# Altium project StudioLightPanel.PrjPcb
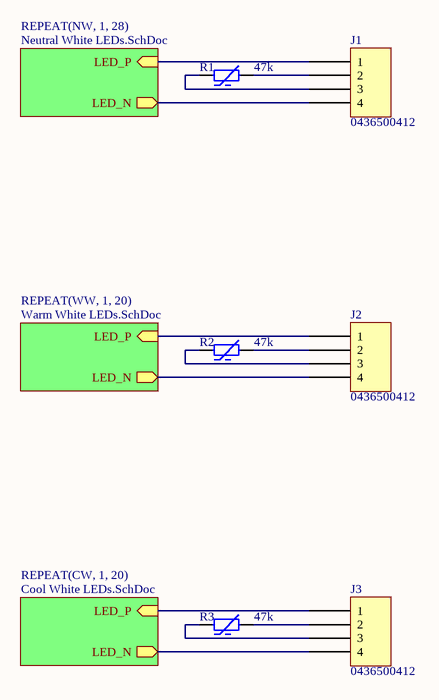
[diagram p0: Studio Light Panel.SchDoc]
4 sheets, 278 parts. Net scope: hierarchical (ports join the sheet entries above them; power ports are global).
Board files: Light Panel.PcbDoc, JumperBoard.PcbDoc
Sheets:
  Studio Light Panel.SchDoc
    CW1 = Cool White LEDs.SchDoc
    CW2 = Cool White LEDs.SchDoc
    CW3 = Cool White LEDs.SchDoc
    CW4 = Cool White LEDs.SchDoc
    CW5 = Cool White LEDs.SchDoc
    CW6 = Cool White LEDs.SchDoc
    CW7 = Cool White LEDs.SchDoc
    CW8 = Cool White LEDs.SchDoc
    CW9 = Cool White LEDs.SchDoc
    CW10 = Cool White LEDs.SchDoc
    CW11 = Cool White LEDs.SchDoc
    CW12 = Cool White LEDs.SchDoc
    CW13 = Cool White LEDs.SchDoc
    CW14 = Cool White LEDs.SchDoc
    CW15 = Cool White LEDs.SchDoc
    CW16 = Cool White LEDs.SchDoc
    CW17 = Cool White LEDs.SchDoc
    CW18 = Cool White LEDs.SchDoc
    CW19 = Cool White LEDs.SchDoc
    CW20 = Cool White LEDs.SchDoc
    WW1 = Warm White LEDs.SchDoc
    WW2 = Warm White LEDs.SchDoc
    WW3 = Warm White LEDs.SchDoc
    WW4 = Warm White LEDs.SchDoc
    WW5 = Warm White LEDs.SchDoc
    WW6 = Warm White LEDs.SchDoc
    WW7 = Warm White LEDs.SchDoc
    WW8 = Warm White LEDs.SchDoc
    WW9 = Warm White LEDs.SchDoc
    WW10 = Warm White LEDs.SchDoc
    WW11 = Warm White LEDs.SchDoc
    WW12 = Warm White LEDs.SchDoc
    WW13 = Warm White LEDs.SchDoc
    WW14 = Warm White LEDs.SchDoc
    WW15 = Warm White LEDs.SchDoc
    WW16 = Warm White LEDs.SchDoc
    WW17 = Warm White LEDs.SchDoc
    WW18 = Warm White LEDs.SchDoc
    WW19 = Warm White LEDs.SchDoc
    WW20 = Warm White LEDs.SchDoc
    NW1 = Neutral White LEDs.SchDoc
    NW2 = Neutral White LEDs.SchDoc
    NW3 = Neutral White LEDs.SchDoc
    NW4 = Neutral White LEDs.SchDoc
    NW5 = Neutral White LEDs.SchDoc
    NW6 = Neutral White LEDs.SchDoc
    NW7 = Neutral White LEDs.SchDoc
    NW8 = Neutral White LEDs.SchDoc
    NW9 = Neutral White LEDs.SchDoc
    NW10 = Neutral White LEDs.SchDoc
    NW11 = Neutral White LEDs.SchDoc
    NW12 = Neutral White LEDs.SchDoc
    NW13 = Neutral White LEDs.SchDoc
    NW14 = Neutral White LEDs.SchDoc
    NW15 = Neutral White LEDs.SchDoc
    NW16 = Neutral White LEDs.SchDoc
    NW17 = Neutral White LEDs.SchDoc
    NW18 = Neutral White LEDs.SchDoc
    NW19 = Neutral White LEDs.SchDoc
    NW20 = Neutral White LEDs.SchDoc
    NW21 = Neutral White LEDs.SchDoc
    NW22 = Neutral White LEDs.SchDoc
    NW23 = Neutral White LEDs.SchDoc
    NW24 = Neutral White LEDs.SchDoc
    NW25 = Neutral White LEDs.SchDoc
    NW26 = Neutral White LEDs.SchDoc
    NW27 = Neutral White LEDs.SchDoc
    NW28 = Neutral White LEDs.SchDoc

## Sheet Studio Light Panel.SchDoc: Studio Light Panel
size A4; SheetNumber: 1; SheetTotal: 4

### Parts
J1  0436500412  [MOLEX 436500412]
J2  0436500412  [MOLEX 436500412]
J3  0436500412  [MOLEX 436500412]
R1  47k  [NTC 0402_1005]
R2  47k  [NTC 0402_1005]
R3  47k  [NTC 0402_1005]

### Sub-sheets
REPEAT(CW, 1, 20) = Cool White LEDs.SchDoc: LED_P (in), LED_N (out)
REPEAT(NW, 1, 28) = Neutral White LEDs.SchDoc: LED_P (in), LED_N (out)
REPEAT(WW, 1, 20) = Warm White LEDs.SchDoc: LED_P (in), LED_N (out)

### Nets
NetD1_WW1_A: J2.1 ; sheet REPEAT(WW, 1, 20)/LED_P
NetD4_WW1_C: J2.4 ; sheet REPEAT(WW, 1, 20)/LED_N
NetD5_CW1_A: J3.1 ; sheet REPEAT(CW, 1, 20)/LED_P
NetD8_CW1_C: J3.4 ; sheet REPEAT(CW, 1, 20)/LED_N
NetD9_NW1_A: J1.1 ; sheet REPEAT(NW, 1, 28)/LED_P
NetD12_NW1_C: J1.4 ; sheet REPEAT(NW, 1, 28)/LED_N
NetJ1_2: J1.2 R1.2
NetJ1_3: J1.3 R1.1
NetJ2_2: J2.2 R2.2
NetJ2_3: J2.3 R2.1
NetJ3_2: J3.2 R3.2
NetJ3_3: J3.3 R3.1

### Notes on the sheet
- Title
- Size:
- Date:
- A4
- Number:
- Time:
- Revision:
- Sheet
- of
- File:

### Library data of the parts
J1-J3 = 0436500412: CONN HEADER SMD R/A 4POS 3MM; Manufacturer: Molex; Material Flammability Rating: UL94 V-0; Number of Positions: 4; Number of Positions Loaded: All; Pitch - Mating: 0.118" (3.00mm); Shrouding: Shrouded - 4 Wall; Style: Board to Cable/Wire; Part Number: 0436500412; ComponentLink1Description: Datasheet; ComponentLink1URL: https://www.molex.com/pdm_docs/sd/436500412_sd.pdf; ComponentLink2Description: DigiKey Link; ComponentLink2URL: https://www.digikey.com/en/products/detail/molex/0436500412/3451041; Connector Type: Header; Contact Finish - Mating: Tin; Contact Finish - Post: Tin; Contact Finish Thickness - Mating: 60.0µin (1.52µm); Contact Material: Brass; Contact Shape: Square; Contact Type: Male Pin; Fastening Type: Locking Ramp; Features: Solder Retention; Insulation Color: Black; Insulation Height: 0.172" (4.37mm); Insulation Material: Liquid Crystal Polymer (LCP), Glass Filled; LastUpdated: 21/03/2022 20:35:03; Lifecycle Status: Active; Minimum Order: 1; Mounting Type: Surface Mount, Right Angle; Number of Rows: 1; Packaging: TapeAndReel; PartId: 134; Part Status: Active; Price: 1.64; Series: Micro-Fit 3.0 43650; Supplier 1: DigiKey; Supplier Part Number 1: WM1892CT-ND; Termination: Solder
R1-R3 = NTCG104BF473FT1X: THERMISTOR NTC 47KOHM 4485K 0402; Manufacturer: TDK Corporation; B25/85: 4550K; B Value Tolerance: ±1%; Power - Max: 100 mW; Part Number: NTCG104BF473FT1X; B25/50: 4485K; ComponentLink1Description: Datasheet; ComponentLink1URL: https://product.tdk.com/info/en/catalog/datasheets/503021/tpd_commercial_ntc-thermistor_ntcg_en.pdf?ref_disty=digikey; ComponentLink2Description: DigiKey Link; ComponentLink2URL: https://www.digikey.com/en/products/detail/tdk-corporation/NTCG104BF473FT1X/5285693; Device Package: 0402 (1005 Metric); LastUpdated: 21/03/2022 19:01:14; Lifecycle Status: Active; Minimum Order: 1; Mounting Type: Surface Mount; Operating Temperature: -40°C ~ 125°C; Package / Case: 0402 (1005 Metric); Packaging: TapeAndReel; PartId: 53; Part Status: Active; Price: 0.03; Resistance in Ohms @ 25°C: 47k; Resistance Tolerance: ±1%; Series: NTCG; Supplier 1: DigiKey; Supplier Part Number 1: 445-174900-1-ND; Value: 47k

## Sheet Cool White LEDs.SchDoc: Cool White
size A4; SheetNumber: 3; SheetTotal: 4
Used 20 times, as channels CW1, CW2, CW3, CW4, CW5, CW6, CW7, CW8, CW9, CW10, CW11, CW12, CW13, CW14, CW15, CW16, CW17, CW18, CW19, CW20. Parts and nets are listed once, with the designators drawn on the sheet.
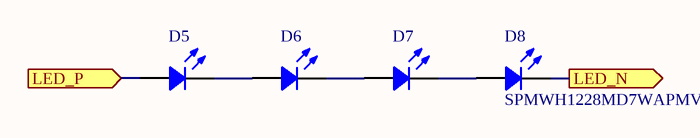
[diagram p1: Cool White LEDs.SchDoc]

### Parts
D5  SPMWH1228MD7WAPMVL  [SAMSUNG LM281BPLUS]  (value not drawn)
D6  SPMWH1228MD7WAPMVL  [SAMSUNG LM281BPLUS]  (value not drawn)
D7  SPMWH1228MD7WAPMVL  [SAMSUNG LM281BPLUS]  (value not drawn)
D8  SPMWH1228MD7WAPMVL  [SAMSUNG LM281BPLUS]

### Ports
LED_N (out), LED_P (in)

### Nets
LED_N: D8.C ; port LED_N
LED_P: D5.A ; port LED_P
NetD5_C: D5.C D6.A
NetD6_C: D6.C D7.A
NetD7_C: D7.C D8.A

### Channels
CW1: designators end in _CW1; ports LED_N=NetD8_CW1_C LED_P=NetD5_CW1_A
CW2: designators end in _CW2; ports LED_N=NetD8_CW1_C LED_P=NetD5_CW1_A
CW3: designators end in _CW3; ports LED_N=NetD8_CW1_C LED_P=NetD5_CW1_A
CW4: designators end in _CW4; ports LED_N=NetD8_CW1_C LED_P=NetD5_CW1_A
CW5: designators end in _CW5; ports LED_N=NetD8_CW1_C LED_P=NetD5_CW1_A
CW6: designators end in _CW6; ports LED_N=NetD8_CW1_C LED_P=NetD5_CW1_A
CW7: designators end in _CW7; ports LED_N=NetD8_CW1_C LED_P=NetD5_CW1_A
CW8: designators end in _CW8; ports LED_N=NetD8_CW1_C LED_P=NetD5_CW1_A
CW9: designators end in _CW9; ports LED_N=NetD8_CW1_C LED_P=NetD5_CW1_A
CW10: designators end in _CW10; ports LED_N=NetD8_CW1_C LED_P=NetD5_CW1_A
CW11: designators end in _CW11; ports LED_N=NetD8_CW1_C LED_P=NetD5_CW1_A
CW12: designators end in _CW12; ports LED_N=NetD8_CW1_C LED_P=NetD5_CW1_A
CW13: designators end in _CW13; ports LED_N=NetD8_CW1_C LED_P=NetD5_CW1_A
CW14: designators end in _CW14; ports LED_N=NetD8_CW1_C LED_P=NetD5_CW1_A
CW15: designators end in _CW15; ports LED_N=NetD8_CW1_C LED_P=NetD5_CW1_A
CW16: designators end in _CW16; ports LED_N=NetD8_CW1_C LED_P=NetD5_CW1_A
CW17: designators end in _CW17; ports LED_N=NetD8_CW1_C LED_P=NetD5_CW1_A
CW18: designators end in _CW18; ports LED_N=NetD8_CW1_C LED_P=NetD5_CW1_A
CW19: designators end in _CW19; ports LED_N=NetD8_CW1_C LED_P=NetD5_CW1_A
CW20: designators end in _CW20; ports LED_N=NetD8_CW1_C LED_P=NetD5_CW1_A

### Notes on the sheet
- Title
- Size:
- Date:
- A4
- Number:
- Time:
- Revision:
- Sheet
- of
- File:

### Library data of the parts
D5-D8 = SPMWH1228MD7WAPMVL: LED; Manufacturer: Samsung Semiconductor, Inc.; CCT (K): 6500K; Color: White, Cool; CRI (Color Rendering Index): 90; Current - Max: 250mA; Current - Test: 65mA; Flux @ 25°C, Current - Test: 33lm (32lm ~ 34lm); Lumens/Watt @ Current - Test: 181 lm/W; Viewing Angle: 120°; Voltage - Forward (Vf) (Typ): 2.8V; Part Number: SPMWH1228MD7WAPMVL; ComponentLink1Description: Datasheet; ComponentLink1URL: https://media.digikey.com/pdf/Data%20Sheets/Samsung%20PDFs/LM281B_Plus%20Pro_VLrank_Rev_0.3_8-4-20.pdf; ComponentLink2Description: DigiKey Link; ComponentLink2URL: https://www.digikey.com/en/products/detail/samsung-semiconductor-inc/SPMWH1228MD7WAPMVL/13926354; Device Package: 1411 (3528 Metric); Height - Seated (Max): 0.031" (0.80mm); LastUpdated: 21/03/2022 19:15:16; Lifecycle Status: Active; Minimum Order: 1; Mounting Type: Surface Mount; Package / Case: 1411 (3528 Metric); Packaging: TapeAndReel; PartId: 129; Part Status: Active; Price: 0.05; Series: LM281B+; Size / Dimension: 0.138" L x 0.110" W (3.50mm x 2.80mm); Supplier 1: DigiKey; Supplier Part Number 1: 1510-SPMWH1228MD7WAPMVLCT-ND; Supplier Device Package: 1411

## Sheet Warm White LEDs.SchDoc: Warm White
size A4; SheetNumber: 2; SheetTotal: 4
Used 20 times, as channels WW1, WW2, WW3, WW4, WW5, WW6, WW7, WW8, WW9, WW10, WW11, WW12, WW13, WW14, WW15, WW16, WW17, WW18, WW19, WW20. Parts and nets are listed once, with the designators drawn on the sheet.
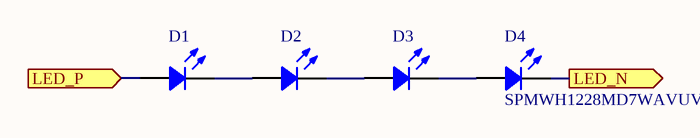
[diagram p2: Warm White LEDs.SchDoc]

### Parts
D1  SPMWH1228MD7WAVUVK  [SAMSUNG LM281BPLUS]  (value not drawn)
D2  SPMWH1228MD7WAVUVK  [SAMSUNG LM281BPLUS]  (value not drawn)
D3  SPMWH1228MD7WAVUVK  [SAMSUNG LM281BPLUS]  (value not drawn)
D4  SPMWH1228MD7WAVUVK  [SAMSUNG LM281BPLUS]

### Ports
LED_N (out), LED_P (in)

### Nets
LED_N: D4.C ; port LED_N
LED_P: D1.A ; port LED_P
NetD1_C: D1.C D2.A
NetD2_C: D2.C D3.A
NetD3_C: D3.C D4.A

### Channels
WW1: designators end in _WW1; ports LED_N=NetD4_WW1_C LED_P=NetD1_WW1_A
WW2: designators end in _WW2; ports LED_N=NetD4_WW1_C LED_P=NetD1_WW1_A
WW3: designators end in _WW3; ports LED_N=NetD4_WW1_C LED_P=NetD1_WW1_A
WW4: designators end in _WW4; ports LED_N=NetD4_WW1_C LED_P=NetD1_WW1_A
WW5: designators end in _WW5; ports LED_N=NetD4_WW1_C LED_P=NetD1_WW1_A
WW6: designators end in _WW6; ports LED_N=NetD4_WW1_C LED_P=NetD1_WW1_A
WW7: designators end in _WW7; ports LED_N=NetD4_WW1_C LED_P=NetD1_WW1_A
WW8: designators end in _WW8; ports LED_N=NetD4_WW1_C LED_P=NetD1_WW1_A
WW9: designators end in _WW9; ports LED_N=NetD4_WW1_C LED_P=NetD1_WW1_A
WW10: designators end in _WW10; ports LED_N=NetD4_WW1_C LED_P=NetD1_WW1_A
WW11: designators end in _WW11; ports LED_N=NetD4_WW1_C LED_P=NetD1_WW1_A
WW12: designators end in _WW12; ports LED_N=NetD4_WW1_C LED_P=NetD1_WW1_A
WW13: designators end in _WW13; ports LED_N=NetD4_WW1_C LED_P=NetD1_WW1_A
WW14: designators end in _WW14; ports LED_N=NetD4_WW1_C LED_P=NetD1_WW1_A
WW15: designators end in _WW15; ports LED_N=NetD4_WW1_C LED_P=NetD1_WW1_A
WW16: designators end in _WW16; ports LED_N=NetD4_WW1_C LED_P=NetD1_WW1_A
WW17: designators end in _WW17; ports LED_N=NetD4_WW1_C LED_P=NetD1_WW1_A
WW18: designators end in _WW18; ports LED_N=NetD4_WW1_C LED_P=NetD1_WW1_A
WW19: designators end in _WW19; ports LED_N=NetD4_WW1_C LED_P=NetD1_WW1_A
WW20: designators end in _WW20; ports LED_N=NetD4_WW1_C LED_P=NetD1_WW1_A

### Notes on the sheet
- Title
- Size:
- Date:
- A4
- Number:
- Time:
- Revision:
- Sheet
- of
- File:

### Library data of the parts
D1-D4 = SPMWH1228MD7WAVUVK: LED; Manufacturer: Samsung Semiconductor, Inc.; CCT (K): 3000K 3-Step MacAdam Ellipse; Color: White, Warm; CRI (Color Rendering Index): 90; Current - Max: 200mA; Current - Test: 65mA; Flux @ 25°C, Current - Test: 30lm (29lm ~ 31lm); Lumens/Watt @ Current - Test: 165 lm/W; Viewing Angle: 120°; Voltage - Forward (Vf) (Typ): 2.8V; Part Number: SPMWH1228MD7WAVUVK; ComponentLink1Description: Datasheet; ComponentLink1URL: https://cdn.samsung.com/led/file/resource/2020/07/Data_Sheet_LM281B_Plus_Pro_VK_Rev.0.8.pdf; ComponentLink2Description: DigiKey Link; ComponentLink2URL: https://www.digikey.com/en/products/detail/samsung-semiconductor-inc/SPMWH1228MD7WAVUVK/12083623; Height - Seated (Max): 0.030" (0.75mm); LastUpdated: 21/03/2022 19:15:16; Lifecycle Status: Active; Minimum Order: 1; Mounting Type: Surface Mount; Packaging: TapeAndReel; PartId: 112; Part Status: Active; Price: 0.03; Series: LM281B+; Size / Dimension: 0.138" L x 0.110" W (3.50mm x 2.80mm); Supplier 1: DigiKey; Supplier Part Number 1: 1510-SPMWH1228MD7WAVUVKCT-ND; Supplier Device Package: 2835

## Sheet Neutral White LEDs.SchDoc: Neutral White
size A4; SheetNumber: 4; SheetTotal: 4
Used 28 times, as channels NW1, NW2, NW3, NW4, NW5, NW6, NW7, NW8, NW9, NW10, NW11, NW12, NW13, NW14, NW15, NW16, NW17, NW18, NW19, NW20, NW21, NW22, NW23, NW24, NW25, NW26, NW27, NW28. Parts and nets are listed once, with the designators drawn on the sheet.
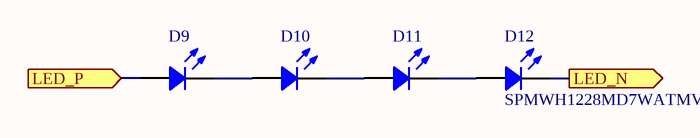
[diagram p3: Neutral White LEDs.SchDoc]

### Parts
D9  SPMWH1228MD7WATMVL  [SAMSUNG LM281BPLUS]  (value not drawn)
D10  SPMWH1228MD7WATMVL  [SAMSUNG LM281BPLUS]  (value not drawn)
D11  SPMWH1228MD7WATMVL  [SAMSUNG LM281BPLUS]  (value not drawn)
D12  SPMWH1228MD7WATMVL  [SAMSUNG LM281BPLUS]

### Ports
LED_N (out), LED_P (in)

### Nets
LED_N: D12.C ; port LED_N
LED_P: D9.A ; port LED_P
NetD9_C: D9.C D10.A
NetD10_C: D10.C D11.A
NetD11_C: D11.C D12.A

### Channels
NW1: designators end in _NW1; ports LED_N=NetD12_NW1_C LED_P=NetD9_NW1_A
NW2: designators end in _NW2; ports LED_N=NetD12_NW1_C LED_P=NetD9_NW1_A
NW3: designators end in _NW3; ports LED_N=NetD12_NW1_C LED_P=NetD9_NW1_A
NW4: designators end in _NW4; ports LED_N=NetD12_NW1_C LED_P=NetD9_NW1_A
NW5: designators end in _NW5; ports LED_N=NetD12_NW1_C LED_P=NetD9_NW1_A
NW6: designators end in _NW6; ports LED_N=NetD12_NW1_C LED_P=NetD9_NW1_A
NW7: designators end in _NW7; ports LED_N=NetD12_NW1_C LED_P=NetD9_NW1_A
NW8: designators end in _NW8; ports LED_N=NetD12_NW1_C LED_P=NetD9_NW1_A
NW9: designators end in _NW9; ports LED_N=NetD12_NW1_C LED_P=NetD9_NW1_A
NW10: designators end in _NW10; ports LED_N=NetD12_NW1_C LED_P=NetD9_NW1_A
NW11: designators end in _NW11; ports LED_N=NetD12_NW1_C LED_P=NetD9_NW1_A
NW12: designators end in _NW12; ports LED_N=NetD12_NW1_C LED_P=NetD9_NW1_A
NW13: designators end in _NW13; ports LED_N=NetD12_NW1_C LED_P=NetD9_NW1_A
NW14: designators end in _NW14; ports LED_N=NetD12_NW1_C LED_P=NetD9_NW1_A
NW15: designators end in _NW15; ports LED_N=NetD12_NW1_C LED_P=NetD9_NW1_A
NW16: designators end in _NW16; ports LED_N=NetD12_NW1_C LED_P=NetD9_NW1_A
NW17: designators end in _NW17; ports LED_N=NetD12_NW1_C LED_P=NetD9_NW1_A
NW18: designators end in _NW18; ports LED_N=NetD12_NW1_C LED_P=NetD9_NW1_A
NW19: designators end in _NW19; ports LED_N=NetD12_NW1_C LED_P=NetD9_NW1_A
NW20: designators end in _NW20; ports LED_N=NetD12_NW1_C LED_P=NetD9_NW1_A
NW21: designators end in _NW21; ports LED_N=NetD12_NW1_C LED_P=NetD9_NW1_A
NW22: designators end in _NW22; ports LED_N=NetD12_NW1_C LED_P=NetD9_NW1_A
NW23: designators end in _NW23; ports LED_N=NetD12_NW1_C LED_P=NetD9_NW1_A
NW24: designators end in _NW24; ports LED_N=NetD12_NW1_C LED_P=NetD9_NW1_A
NW25: designators end in _NW25; ports LED_N=NetD12_NW1_C LED_P=NetD9_NW1_A
NW26: designators end in _NW26; ports LED_N=NetD12_NW1_C LED_P=NetD9_NW1_A
NW27: designators end in _NW27; ports LED_N=NetD12_NW1_C LED_P=NetD9_NW1_A
NW28: designators end in _NW28; ports LED_N=NetD12_NW1_C LED_P=NetD9_NW1_A

### Notes on the sheet
- Title
- Size:
- Date:
- A4
- Number:
- Time:
- Revision:
- Sheet
- of
- File:

### Library data of the parts
D9-D12 = SPMWH1228MD7WATMVL: LED; Manufacturer: Samsung Semiconductor, Inc.; CCT (K): 4000K; Color: White, Neutral; CRI (Color Rendering Index): 90; Current - Max: 250mA; Current - Test: 65mA; Flux @ 25°C, Current - Test: 33lm (32lm ~ 34lm); Lumens/Watt @ Current - Test: 181 lm/W; Viewing Angle: 120°; Voltage - Forward (Vf) (Typ): 2.8V; Part Number: SPMWH1228MD7WATMVL; ComponentLink1Description: Datasheet; ComponentLink1URL: https://media.digikey.com/pdf/Data%20Sheets/Samsung%20PDFs/LM281B_Plus%20Pro_VLrank_Rev_0.3_8-4-20.pdf; ComponentLink2Description: DigiKey Link; ComponentLink2URL: https://www.digikey.com/en/products/detail/samsung-semiconductor-inc/SPMWH1228MD7WATMVL/13926315; Device Package: 1411 (3528 Metric); Height - Seated (Max): 0.031" (0.80mm); LastUpdated: 21/03/2022 19:15:15; Lifecycle Status: Active; Minimum Order: 1; Mounting Type: Surface Mount; Package / Case: 1411 (3528 Metric); Packaging: TapeAndReel; PartId: 111; Part Status: Active; Price: 0.05; Series: LM281B+; Size / Dimension: 0.138" L x 0.110" W (3.50mm x 2.80mm); Supplier 1: DigiKey; Supplier Part Number 1: 1510-SPMWH1228MD7WATMVLCT-ND; Supplier Device Package: 1411

## Nets that join several sheets
NetD1_WW1_A: Studio Light Panel (J2.1), WW1 (D1_WW1.A), WW2 (D1_WW2.A), WW3 (D1_WW3.A), WW4 (D1_WW4.A), WW5 (D1_WW5.A), WW6 (D1_WW6.A), WW7 (D1_WW7.A), WW8 (D1_WW8.A), WW9 (D1_WW9.A), WW10 (D1_WW10.A), WW11 (D1_WW11.A), WW12 (D1_WW12.A), WW13 (D1_WW13.A), WW14 (D1_WW14.A), WW15 (D1_WW15.A), WW16 (D1_WW16.A), WW17 (D1_WW17.A), WW18 (D1_WW18.A), WW19 (D1_WW19.A), WW20 (D1_WW20.A)
NetD4_WW1_C: Studio Light Panel (J2.4), WW1 (D4_WW1.C), WW2 (D4_WW2.C), WW3 (D4_WW3.C), WW4 (D4_WW4.C), WW5 (D4_WW5.C), WW6 (D4_WW6.C), WW7 (D4_WW7.C), WW8 (D4_WW8.C), WW9 (D4_WW9.C), WW10 (D4_WW10.C), WW11 (D4_WW11.C), WW12 (D4_WW12.C), WW13 (D4_WW13.C), WW14 (D4_WW14.C), WW15 (D4_WW15.C), WW16 (D4_WW16.C), WW17 (D4_WW17.C), WW18 (D4_WW18.C), WW19 (D4_WW19.C), WW20 (D4_WW20.C)
NetD5_CW1_A: Studio Light Panel (J3.1), CW1 (D5_CW1.A), CW2 (D5_CW2.A), CW3 (D5_CW3.A), CW4 (D5_CW4.A), CW5 (D5_CW5.A), CW6 (D5_CW6.A), CW7 (D5_CW7.A), CW8 (D5_CW8.A), CW9 (D5_CW9.A), CW10 (D5_CW10.A), CW11 (D5_CW11.A), CW12 (D5_CW12.A), CW13 (D5_CW13.A), CW14 (D5_CW14.A), CW15 (D5_CW15.A), CW16 (D5_CW16.A), CW17 (D5_CW17.A), CW18 (D5_CW18.A), CW19 (D5_CW19.A), CW20 (D5_CW20.A)
NetD8_CW1_C: Studio Light Panel (J3.4), CW1 (D8_CW1.C), CW2 (D8_CW2.C), CW3 (D8_CW3.C), CW4 (D8_CW4.C), CW5 (D8_CW5.C), CW6 (D8_CW6.C), CW7 (D8_CW7.C), CW8 (D8_CW8.C), CW9 (D8_CW9.C), CW10 (D8_CW10.C), CW11 (D8_CW11.C), CW12 (D8_CW12.C), CW13 (D8_CW13.C), CW14 (D8_CW14.C), CW15 (D8_CW15.C), CW16 (D8_CW16.C), CW17 (D8_CW17.C), CW18 (D8_CW18.C), CW19 (D8_CW19.C), CW20 (D8_CW20.C)
NetD9_NW1_A: Studio Light Panel (J1.1), NW1 (D9_NW1.A), NW2 (D9_NW2.A), NW3 (D9_NW3.A), NW4 (D9_NW4.A), NW5 (D9_NW5.A), NW6 (D9_NW6.A), NW7 (D9_NW7.A), NW8 (D9_NW8.A), NW9 (D9_NW9.A), NW10 (D9_NW10.A), NW11 (D9_NW11.A), NW12 (D9_NW12.A), NW13 (D9_NW13.A), NW14 (D9_NW14.A), NW15 (D9_NW15.A), NW16 (D9_NW16.A), NW17 (D9_NW17.A), NW18 (D9_NW18.A), NW19 (D9_NW19.A), NW20 (D9_NW20.A), NW21 (D9_NW21.A), NW22 (D9_NW22.A), NW23 (D9_NW23.A), NW24 (D9_NW24.A), NW25 (D9_NW25.A), NW26 (D9_NW26.A), NW27 (D9_NW27.A), NW28 (D9_NW28.A)
NetD12_NW1_C: Studio Light Panel (J1.4), NW1 (D12_NW1.C), NW2 (D12_NW2.C), NW3 (D12_NW3.C), NW4 (D12_NW4.C), NW5 (D12_NW5.C), NW6 (D12_NW6.C), NW7 (D12_NW7.C), NW8 (D12_NW8.C), NW9 (D12_NW9.C), NW10 (D12_NW10.C), NW11 (D12_NW11.C), NW12 (D12_NW12.C), NW13 (D12_NW13.C), NW14 (D12_NW14.C), NW15 (D12_NW15.C), NW16 (D12_NW16.C), NW17 (D12_NW17.C), NW18 (D12_NW18.C), NW19 (D12_NW19.C), NW20 (D12_NW20.C), NW21 (D12_NW21.C), NW22 (D12_NW22.C), NW23 (D12_NW23.C), NW24 (D12_NW24.C), NW25 (D12_NW25.C), NW26 (D12_NW26.C), NW27 (D12_NW27.C), NW28 (D12_NW28.C)